# Altium schematic sheet PF10_Expander.SchDoc
size 177 x 101 mm
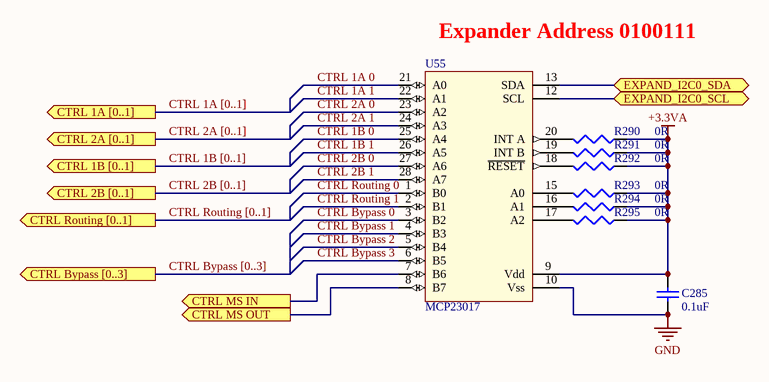
[diagram p0: PF10_Expander.SchDoc]

## Parts
C285  0.1uF  [CAPC1608X08]
R290  0R  [RESC1608X05]
R291  0R  [RESC1608X05]
R292  0R  [RESC1608X05]
R293  0R  [RESC1608X05]
R294  0R  [RESC1608X05]
R295  0R  [RESC1608X05]
U55  MCP23017  [SOIC28_MCP23017]

## Ports
CTRL 1A [0..1] (out), CTRL 1B [0..1] (out), CTRL 2A [0..1] (out), CTRL 2B [0..1] (out), CTRL Bypass [0..3] (out), CTRL MS IN (out), CTRL MS OUT (out), CTRL Routing [0..1] (out), EXPAND_I2C0_SCL, EXPAND_I2C0_SDA

## Nets
+3.3VA: C285.1 R290.1 R291.1 R292.1 R293.1 R294.1 R295.1 U55.9(Vdd)
GND: C285.2 U55.10(Vss)
CTRL 1A 0: U55.21(A0)
CTRL 1A 1: U55.22(A1)
CTRL 1B 0: U55.25(A4)
CTRL 1B 1: U55.26(A5)
CTRL 2A 0: U55.23(A2)
CTRL 2A 1: U55.24(A3)
CTRL 2B 0: U55.27(A6)
CTRL 2B 1: U55.28(A7)
CTRL Bypass 0: U55.3(B2)
CTRL Bypass 1: U55.4(B3)
CTRL Bypass 2: U55.5(B4)
CTRL Bypass 3: U55.6(B5)
CTRL MS IN: U55.7(B6) ; port CTRL MS IN
CTRL MS OUT: U55.8(B7) ; port CTRL MS OUT
CTRL Routing 0: U55.1(B0)
CTRL Routing 1: U55.2(B1)
EXPAND_I2C0_SCL: U55.12(SCL) ; port EXPAND_I2C0_SCL
EXPAND_I2C0_SDA: U55.13(SDA) ; port EXPAND_I2C0_SDA
NetR290_2: R290.2 U55.20(INT_A)
NetR291_2: R291.2 U55.19(INT_B)
NetR292_2: R292.2 U55.18(~{RESET})
NetR293_2: R293.2 U55.15(A0)
NetR294_2: R294.2 U55.16(A1)
NetR295_2: R295.2 U55.17(A2)

## Buses and harness runs
bus CTRL 1A [0..1] = port CTRL 1A [0..1]
bus CTRL 1B [0..1] = port CTRL 1B [0..1]
bus CTRL 2A [0..1] = port CTRL 2A [0..1]
bus CTRL 2B [0..1] = port CTRL 2B [0..1]
bus CTRL Bypass [0..3] = port CTRL Bypass [0..3]
bus CTRL Routing [0..1] = port CTRL Routing [0..1]

## Notes on the sheet
- (near U55) Expander Address 0100111

## Library data of the parts
C285 = Cap Semi: Capacitor (Semiconductor SIM Model); Fabricant: MURATA; Fournisseur: Farnell; RefFabricant: GRM188F51E104ZA01D; RefFournisseur: 2821272; Value: 0.1uF; Case: 0603 [1608 Metric]; DataSheet: http://www.farnell.com/datasheets/2048672.pdf
R290-R295 = Res3: Resistor; Value: 0; Case: 0603 [1608 Metric]
U55 = MCP23017: 16b I/O Expander; Fabricant: MICROCHIP; Fournisseur: Farnell; RefFabricant: MCP23017-E/SO; RefFournisseur: 1332087; DataSheet: http://www.farnell.com/datasheets/12179.pdf